# Altium schematic sheet [05] - POWER.SchDoc
size A2; Organization: Altium Limited; Address1: L3, 12a Rodborough Rd; Address2: Frenchs Forest; Address3: NSW; Address4: Australia 2086; DocumentNumber: 5; SheetNumber: 5; SheetTotal: 11
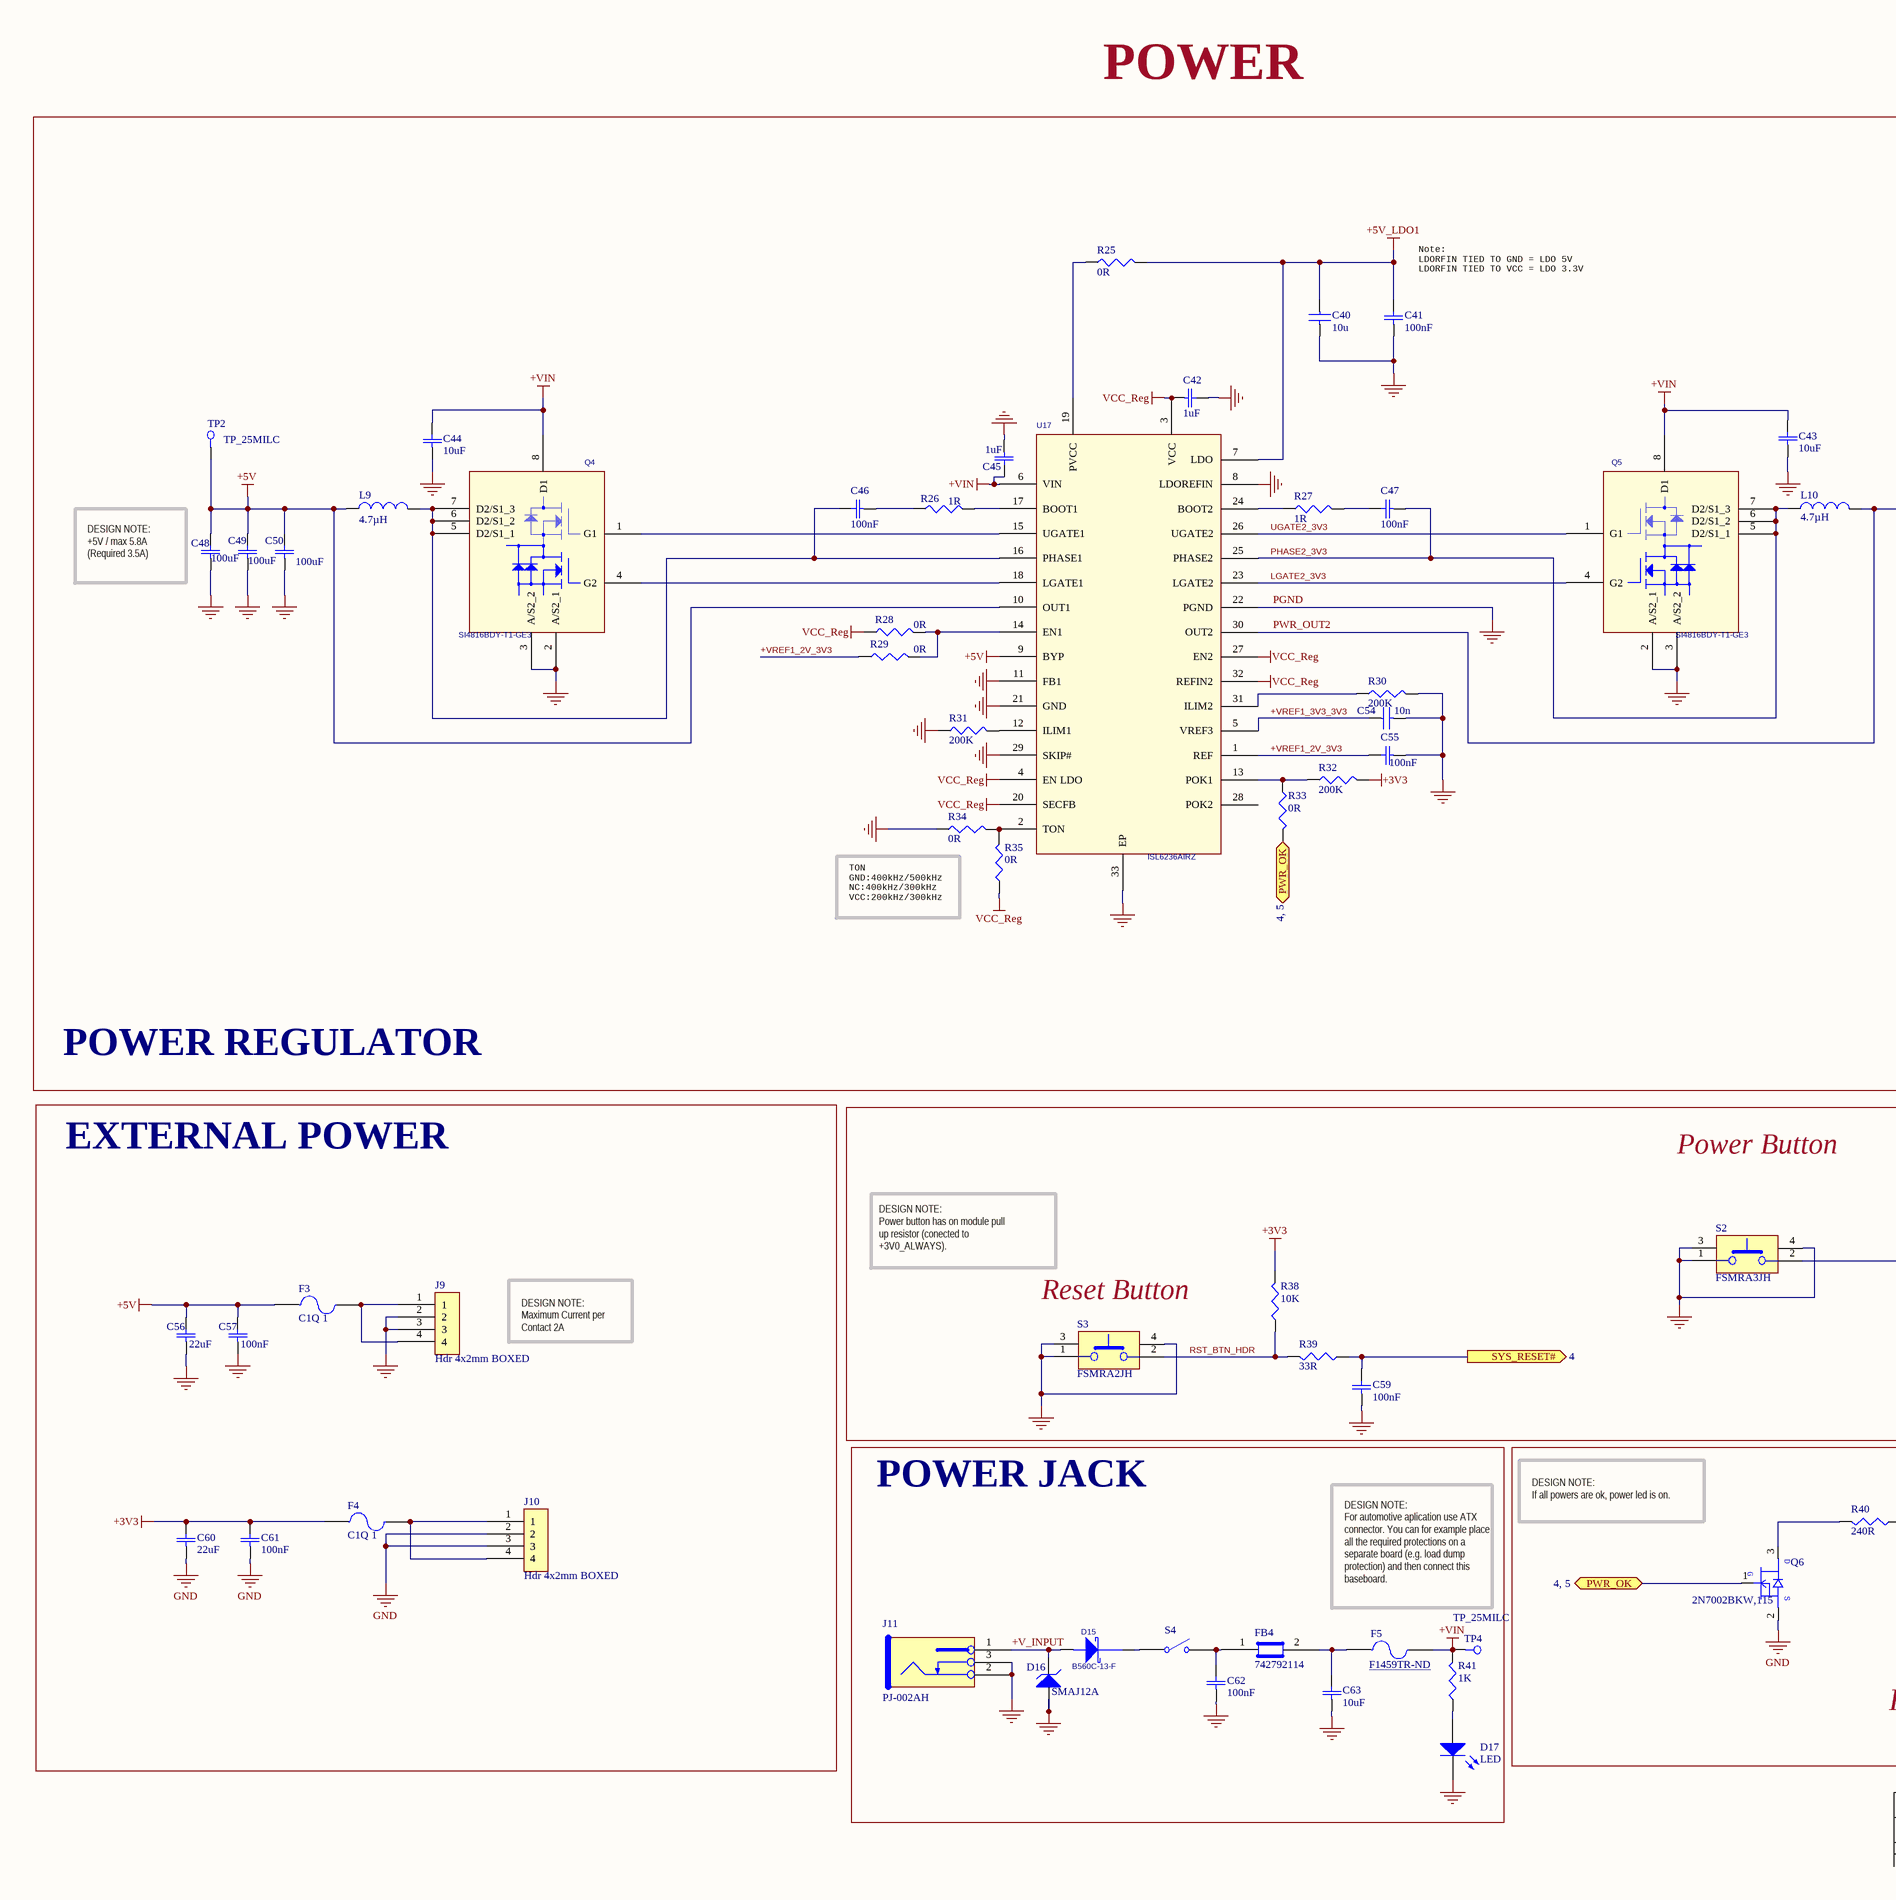
[diagram p0: [05] - POWER.SchDoc, left]
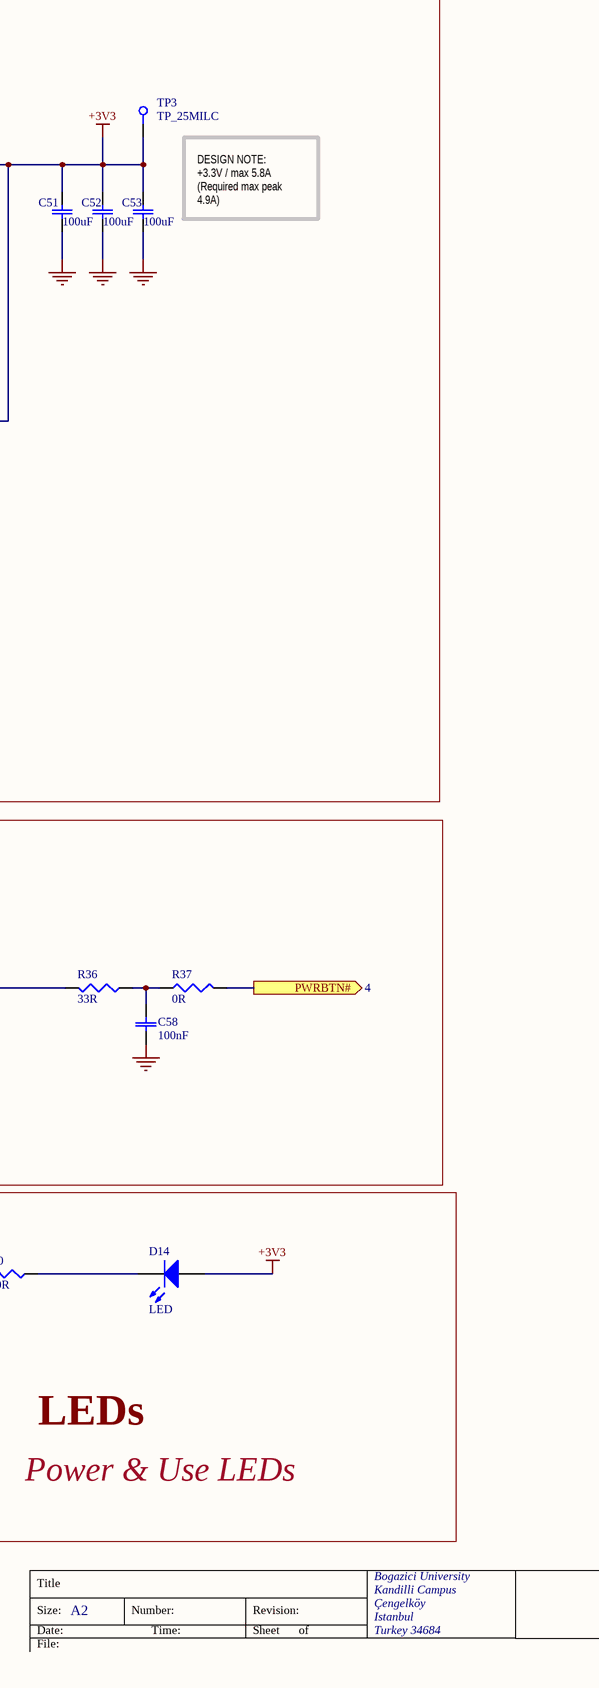
[diagram p1: [05] - POWER.SchDoc, right]

## Parts
C40  10u  [C0603]
C41  100nF  [C0402]
C42  1uF  [CAP_3216]
C43  10uF  [CAP_3216]
C44  10uF  [CAP_3216]
C45  1uF  [CAP_3216]
C46  100nF  [C0402]
C47  100nF  [C0402]
C48  100uF  [C1210C]
C49  100uF  [C1210C]
C50  100uF  [C1210C]
C51  100uF  [C1210C]
C52  100uF  [C1210C]
C53  100uF  [C1210C]
C54  10n  [C0402]
C55  100nF  [C0402]
C56  22uF  [C0805]
C57  100nF  [C0402]
C58  100nF  [C0402]
C59  100nF  [C0402]
C60  22uF  [C0805]
C61  100nF  [C0402]
C62  100nF  [C0402]
C63  10uF  [CAP_3216]
D14  LED  [D0603_Directional]
D15  B560C-13-F  [SMC]
D16  SMAJ12A  [SMA / DO-214AC]
D17  LED  [D0603_Directional]
F3  C1Q 1  [C1]
F4  C1Q 1  [C1]
F5  F1459TR-ND  [0466Series]
FB4  742792114  [Ferrite bead]
J9  Hdr 4x2mm BOXED  [HDR_1x4_2MM_SHDR]
J10  Hdr 4x2mm BOXED  [HDR_1x4_2MM_SHDR]
J11  PJ-002AH  [POWER_JACK_5.5_2.1MM_NS]
L9  4.7µH  [IHLP_255MILx270MIL]
L10  4.7µH  [IHLP_255MILx270MIL]
Q4  SI4816BDY-T1-GE3  [8_SOIC_3.9MM]
Q5  SI4816BDY-T1-GE3  [8_SOIC_3.9MM]
Q6  2N7002BKW,115  [SC70_SOT323]
R25  0R  [R0402]
R26  1R  [R0402]
R27  1R  [R0402]
R28  0R  [R0402]
R29  0R  [R0402]
R30  200K  [R0402]
R31  200K  [R0402]
R32  200K  [R0402]
R33  0R  [R0402]
R34  0R  [R0402]
R35  0R  [R0402]
R36  33R  [R0402]
R37  0R  [R0402]
R38  10K  [R0402]
R39  33R  [R0402]
R40  240R  [R0402]
R41  1K  [R0402]
S2  FSMRA3JH  [FSMRA3JH]
S3  FSMRA2JH  [FSMRA2JH]
S4  R1966ABLKBLKGR  [RockerSwitch]  (value not drawn)
TP2  TP_25MILC  [TP_25C]  (no BOM)
TP3  TP_25MILC  [TP_25C]  (no BOM)
TP4  TP_25MILC  [TP_25C]  (no BOM)
U17  ISL6236AIRZ  [32_VFQFN_EXPOSED_PAD]

## Blocks framed on the sheet
POWER REGULATOR: C40-C55 L9 L10 Q4 Q5 R25-R35 TP2 TP3 U17
EXTERNAL POWER: C56 C57 C60 C61 F3 F4 J9 J10
POWER JACK: C62 C63 D15-D17 F5 FB4 J11 R41 S4 TP4
LEDs: D14 Q6 R40

## Ports
PWR_OK (bidir, see 4, 5), PWRBTN# (out, see 4), SYS_RESET# (out, see 4)

## Nets
+5V: C48.2 C49.2 C50.2 C56.2 C57.2 F3.1 L9.1 TP2.1 U17.9(BYP) U17.10(OUT1)
+5V_LDO1: C40.1 C41.2 R25.2 U17.7(LDO)
+VIN: C43.2 C44.2 C45.2 F5.2 Q4.8(D1) Q5.8(D1) R41.2 TP4.1 U17.6(VIN)
PGND: C40.2 C41.1 C42.2 C43.1 C44.1 C45.1 C48.1 C49.1 C50.1 C51.1 C52.1 C53.1 C54.2 C55.1 C56.1 C57.1 C58.1 C59.1 C60.1 C61.1 C62.1 C63.1 D16.1(A) D17.2(K) J9.2 J9.3 J10.2 J10.3 J11.2 J11.3 Q4.2(A/S2_1) Q4.3(A/S2_2) Q5.2(A/S2_1) Q5.3(A/S2_2) Q6.2(SOURCE) R30.2 R31.1 R34.1 S2.1 S2.3(MECH1) S2.4(MECH2) S3.1 S3.3(MECH1) S3.4(MECH2) U17.8(LDOREFIN) U17.11(FB1) U17.21(GND) U17.22(PGND) U17.29(SKIP#) U17.33(EP)  [also labelled GND]
PWR_OUT2: C51.2 C52.2 C53.2 C60.2 C61.2 D14.1(A) F4.1 L10.2 R32.2 R38.2 TP3.1 U17.30(OUT2)  [also labelled +3V3]
VCC_Reg: C42.1 R28.1 R35.1 U17.3(VCC) U17.4(EN_LDO) U17.20(SECFB) U17.27(EN2) U17.32(REFIN2)
+V_INPUT: D15.2(ANODE) D16.2(K) J11.1
+VREF1_2V_3V3: C55.2 R29.1 U17.1(REF)
+VREF1_3V3_3V3: C54.1 U17.5(VREF3)
LGATE2_3V3: Q5.4(G2) U17.23(LGATE2)
PHASE2_3V3: C47.1 L10.1 Q5.5(D2/S1_1) Q5.6(D2/S1_2) Q5.7(D2/S1_3) U17.25(PHASE2)
PWR_OK: Q6.1(GATE) R33.2 ; port PWR_OK
PWRBTN#: R37.2 ; port PWRBTN#
RST_BTN_HDR: R38.1 R39.2 S3.2
SYS_RESET#: C59.2 R39.1 ; port SYS_RESET#
UGATE2_3V3: Q5.1(G1) U17.26(UGATE2)
NetC46_1: C46.1 R26.1
NetC46_2: C46.2 L9.2 Q4.5(D2/S1_1) Q4.6(D2/S1_2) Q4.7(D2/S1_3) U17.16(PHASE1)
NetC47_2: C47.2 R27.2
NetC58_2: C58.2 R36.1 R37.1
NetC62_2: C62.2 FB4.1 S4.2(NO)
NetC63_2: C63.2 F5.1 FB4.2
NetD14_2: D14.2(K) R40.1
NetD15_1: D15.1(cathode) S4.1(COMMON)
NetD17_1: D17.1(A) R41.1
NetF3_2: F3.2 J9.1 J9.4
NetF4_2: F4.2 J10.1 J10.4
NetQ4_1: Q4.1(G1) U17.15(UGATE1)
NetQ4_4: Q4.4(G2) U17.18(LGATE1)
NetQ6_3: Q6.3(DRAIN) R40.2
NetR25_1: R25.1 U17.19(PVCC)
NetR26_2: R26.2 U17.17(BOOT1)
NetR27_1: R27.1 U17.24(BOOT2)
NetR28_2: R28.2 R29.2 U17.14(EN1)
NetR30_1: R30.1 U17.31(ILIM2)
NetR31_2: R31.2 U17.12(ILIM1)
NetR32_1: R32.1 R33.1 U17.13(POK1)
NetR34_2: R34.2 R35.2 U17.2(TON)
NetR36_2: R36.2 S2.2

Not connected (* = marked no-connect by the designer): U17 28(POK2)

## Notes on the sheet
- POWER
- (near C41) Note:
  LDORFIN TIED TO GND = LDO 5V
  LDORFIN TIED TO VCC = LDO 3.3V
- DESIGN NOTE:
  +3.3V / max 5.8A
  (Required max peak 4.9A)
- (near C48) DESIGN NOTE:
  +5V / max 5.8A
  (Required 3.5A)
- TON
  GND:400kHz/500kHz
  NC:400kHz/300kHz
  VCC:200kHz/300kHz
- Power Button
- DESIGN NOTE:
  Power button has on module pull
  up resistor (conected to
  +3V0_ALWAYS).
- (near S3) Reset Button
- DESIGN NOTE:
  Maximum Current per Contact 2A
- DESIGN NOTE:
  If all powers are ok, power led is on.
- DESIGN NOTE:
  For automotive aplication use ATX connector. You can for example place all the required protections on a separate board (e.g. load dump protection) and then connect this baseboard.
- Power & Use LEDs
- Title
- Bogazici University
- Size:
- Date:
- File:
- A2
- Number:
- Time:
- Revision:
- Sheet
- of
- Kandilli Campus
- Çengelköy
- Istanbul
- Turkey 34684
- (in symbol 2N7002BKW,115) D; G; S

## Library data of the parts
C40 = C1608X5R0J106M: CAP CER 10UF 6.3V X5R 20% 0603; Manufacturer: TDK Corporation; Capacitance: 10µF; Value: 10µF; Category: Capacitors; Manufacturer Part Number: C1608X5R0J106M; Operating Temperature: -55°C ~ 85°C; Package / Case: 0603 (1608 Metric); Price 1k [$]: 0.08580; Voltage - Rated: 6.3V; Features: Low ESR; Supplier Part Number: 445-4112-1-ND; Supplier: Digikey; Supplier 1: Digi-Key; Supplier Part Number 1: 445-4112-1-ND; RoHS: RoHS Compliant; Stock 1: 48157; Pricing 1: 1=0.46, 10=0.363, 100=0.1898, 250=0.14024, 500=0.1089, 1000=0.0858 (USD); Tolerance: ±20%; Temperature Coefficient: X5R; Mounting Type: Surface Mount, MLCC; Applications: General Purpose; Ratings: -; Size / Dimension: 0.063" L x 0.031" W (1.60mm x 0.80mm); Height - Seated (Max): -; Thickness (Max): 0.037" (0.95mm); Lead Spacing: -; Packaging: Cut Tape (CT); Lead Style: -; ComponentLink1URL: http://www.tdk.com/pdf/general_B11.pdf; ComponentLink1Description: http://www.tdk.com/pdf/general_B11.pdf
C41 C46 C47 C55 C57-C59 C61 C62 = CL05A104KA5NNNC: CAP CER 0.1UF 50V X8R 0603; Manufacturer 1: Samsung Electro-Mechanics; Voltage - Rated: 25V; Tolerance: ±10%; Temperature Coefficient: X5R; Notification: Current market demand for these product types have resulted in fluctuating and extending lead times. Lead times may differ.; Description 1: CAP CER 0.1UF 25V X5R 0402; Category: Capacitors; Operating Temperature: -55°C ~ 85°C; Package / Case: 0402 (1005 Metric); Supplier 1: Digi-Key; Supplier Part Number 1: 1276-1043-6-ND; RoHS: RoHS Compliant; Stock 1: 100000; Pricing 1: 1=0.1, 10=0.04, 100=0.0176, 500=0.0126, 1000=0.0099, 2500=0.009, 5000=0.00828 (USD); Mounting Type: Surface Mount, MLCC; Applications: General Purpose; Ratings: -; Size / Dimension: 0.039" L x 0.020" W (1.00mm x 0.50mm); Height - Seated (Max): -; Thickness (Max): 0.022" (0.55mm); Lead Spacing: -; Features: -; Packaging: Digi-Reel®; Lead Style: -; ComponentLink1URL: http://www.samsungsem.com/kr/support/product-search/mlcc/CL05A104KA5NNNC.jsp; ComponentLink1Description: http://www.samsungsem.com/kr/support/product-search/mlcc/CL05A104KA5NNNC.jsp; Manufacturer Part Number 1: CL05A104KA5NNNC; Part Status: Active
C42 = CGA5L3X8R1H105K1: CAP CER 1UF 50V X8R 1206; Manufacturer_Part_Number: CGA5L3X8R1H105K160AB; Manufacturer 1: TDK Corporation; Vendor: TDK; Built_By: EMA_UL_Team; Type: DEV; C: Copyright (C) 2015 Accelerated Designs. All rights reserved; Tolerance: ±10%; RefDes: RefDes; Value: Value; Manufacturer Part Number 1: CGA5L3X8R1H105K160AB; RoHS: RoHS Compliant; Stock 1: 3285; Pricing 1: 1=0.85, 10=0.628, 100=0.4306, 500=0.34086, 1000=0.28704 (USD); Packaging: Cut Tape (CT); Part Status: Active; Voltage - Rated: 50V; Temperature Coefficient: X8R; Operating Temperature: -55°C ~ 150°C; Features: High Temperature; Ratings: AEC-Q200; Applications: Automotive; Failure Rate: -; Mounting Type: Surface Mount, MLCC; Package / Case: 1206 (3216 Metric); Size / Dimension: 0.126" L x 0.063" W (3.20mm x 1.60mm); Height - Seated (Max): -; Thickness (Max): 0.071" (1.80mm); Lead Spacing: -; Lead Style: -; ComponentLink1URL: https://product.tdk.com/info/en/catalog/datasheets/mlcc_automotive_hightemp_en.pdf; ComponentLink1Description: https://product.tdk.com/info/en/catalog/datasheets/mlcc_automotive_hightemp_en.pdf; Supplier 1: Digi-Key; Supplier Part Number 1: 445-13000-1-ND; Description 1: CAP CER 1UF 50V X8R 1206; Category: Capacitors
C43 C44 C63 = C3216JB1V106K160: CAP CER 10UF 35V JB 1206; Manufacturer_Part_Number: C3216JB1V106K160AB; Manufacturer 1: TDK Corporation; Tolerance: ±10%; Vendor: TDK; Built_By: EMA_UL_Team; Type: DEV; C: Copyright (C) 2015 Accelerated Designs. All rights reserved; Notification: Current market demand for these product types have resulted in fluctuating and extending lead times. Lead times may differ.; Category: Capacitors; Operating Temperature: -25°C ~ 85°C; Package / Case: 1206 (3216 Metric); Value: Value; Voltage - Rated: 35V; Supplier 1: Digi-Key; Supplier Part Number 1: 445-11736-1-ND; RoHS: RoHS Compliant; Stock 1: 5285; Pricing 1: 1=0.92, 10=0.648, 100=0.4269, 500=0.31626, 1000=0.26881 (USD); Temperature Coefficient: JB; Mounting Type: Surface Mount, MLCC; Applications: General Purpose; Ratings: -; Size / Dimension: 0.126" L x 0.063" W (3.20mm x 1.60mm); Height - Seated (Max): -; Thickness (Max): 0.069" (1.75mm); Lead Spacing: -; Features: Low ESL; Packaging: Cut Tape (CT); Lead Style: -; ComponentLink1URL: https://product.tdk.com/info/en/catalog/datasheets/mlcc_commercial_general_en.pdf; ComponentLink1Description: https://product.tdk.com/info/en/catalog/datasheets/mlcc_commercial_general_en.pdf; RefDes: RefDes; Manufacturer Part Number 1: C3216JB1V106K160AB; Part Status: Active; Failure Rate: -; Description 1: CAP CER 10UF 35V JB 1206
C45 = CGA5L3X8R1H105K1: CAP CER 1UF 50V X8R 1206; Manufacturer_Part_Number: CGA5L3X8R1H105K160AB; Manufacturer 1: TDK Corporation; Tolerance: ±10%; Vendor: TDK; Built_By: EMA_UL_Team; Type: DEV; C: Copyright (C) 2015 Accelerated Designs. All rights reserved; Category: Capacitors; Operating Temperature: -55°C ~ 150°C; Package / Case: 1206 (3216 Metric); Value: Value; Voltage - Rated: 50V; Supplier 1: Digi-Key; Supplier Part Number 1: 445-13000-1-ND; RoHS: RoHS Compliant; Stock 1: 3285; Pricing 1: 1=0.85, 10=0.628, 100=0.4306, 500=0.34086, 1000=0.28704 (USD); Temperature Coefficient: X8R; Mounting Type: Surface Mount, MLCC; Applications: Automotive; Ratings: AEC-Q200; Size / Dimension: 0.126" L x 0.063" W (3.20mm x 1.60mm); Height - Seated (Max): -; Thickness (Max): 0.071" (1.80mm); Lead Spacing: -; Features: High Temperature; Packaging: Cut Tape (CT); Lead Style: -; ComponentLink1URL: https://product.tdk.com/info/en/catalog/datasheets/mlcc_automotive_hightemp_en.pdf; ComponentLink1Description: https://product.tdk.com/info/en/catalog/datasheets/mlcc_automotive_hightemp_en.pdf; RefDes: RefDes; Manufacturer Part Number 1: CGA5L3X8R1H105K160AB; Part Status: Active; Failure Rate: -; Description 1: CAP CER 1UF 50V X8R 1206
C48-C53 = CL32A107MPVNNNE: CAP CER 100UF 10V X5R 1210; Manufacturer_Part_Number: C1210C107M8PACTU; Manufacturer 1: Samsung Electro-Mechanics; Tolerance: ±20%; Vendor: Kemet; Built_By: EMA_UL_Team; Type: DEV; C: Copyright (C) 2015 Accelerated Designs. All rights reserved; Notification: Current market demand for these product types have resulted in fluctuating and extending lead times. Lead times may differ.; Category: Capacitors; Operating Temperature: -55°C ~ 85°C; Package / Case: 1210 (3225 Metric); Value: 100uF; Voltage - Rated: 10V; Supplier 1: Digi-Key; Supplier Part Number 1: 1276-3364-1-ND; RoHS: RoHS Compliant; Stock 1: 10000; Pricing 1: 1=1.23, 10=0.97, 100=0.7277, 500=0.54984 (USD); Temperature Coefficient: X5R; Mounting Type: Surface Mount, MLCC; Applications: General Purpose; Ratings: -; Size / Dimension: 0.126" L x 0.098" W (3.20mm x 2.50mm); Height - Seated (Max): -; Thickness (Max): 0.110" (2.80mm); Lead Spacing: -; Features: -; Packaging: Cut Tape (CT); Lead Style: -; ComponentLink1URL: http://www.samsungsem.com/kr/support/product-search/mlcc/CL32A107MPVNNNE.jsp; ComponentLink1Description: http://www.samsungsem.com/kr/support/product-search/mlcc/CL32A107MPVNNNE.jsp; RefDes: RefDes; Manufacturer Part Number 1: CL32A107MPVNNNE; Part Status: Active; Description 1: CAP CER 100UF 10V X5R 1210
C54 = C1005X7R1C103K: CAP CER 10000PF 16V X7R 10% 0402; Manufacturer: TDK Corporation; Value: 10nF; Capacitance: 10000pF; Category: Capacitors; Manufacturer Part Number: C1005X7R1C103K; Operating Temperature: -55°C ~ 125°C; Package / Case: 0402 (1005 Metric); Price 1k [$]: 0.00416; Voltage - Rated: 16V; Supplier Part Number: 445-1262-1-ND; Supplier: Digikey; Supplier 1: Digi-Key; Supplier Part Number 1: 445-1262-1-ND; RoHS: RoHS Compliant; Stock 1: 511497; Pricing 1: 1=0.08, 10=0.05, 100=0.018, 250=0.013, 500=0.0096, 1000=0.0065 (USD); Tolerance: ±10%; Temperature Coefficient: X7R; Mounting Type: Surface Mount, MLCC; Applications: General Purpose; Ratings: -; Size / Dimension: 0.039" L x 0.020" W (1.00mm x 0.50mm); Height - Seated (Max): -; Thickness (Max): 0.022" (0.55mm); Lead Spacing: -; Features: -; Packaging: Cut Tape (CT); Lead Style: -; ComponentLink1URL: http://www.tdk.co.jp/tefe02/e412_c.pdf; ComponentLink1Description: http://www.tdk.co.jp/tefe02/e412_c.pdf
C56 C60 = CL21A226MOCLRNC: CAP CER 22UF 16V X5R 0805; Manufacturer 1: Samsung Electro-Mechanics; Tolerance: ±20%; Notification: Current market demand for these product types have resulted in fluctuating and extending lead times. Lead times may differ.; Supplier 1: Digi-Key; Supplier Part Number 1: 1276-6780-1-ND; RoHS: RoHS Compliant; Category: Capacitors; Stock 1: 40000; Pricing 1: 1=0.34, 10=0.233, 100=0.132, 500=0.09318, 1000=0.08153 (USD); Voltage - Rated: 16V; Temperature Coefficient: X5R; Mounting Type: Surface Mount, MLCC; Operating Temperature: -55°C ~ 85°C; Applications: General Purpose; Ratings: -; Package / Case: 0805 (2012 Metric); Size / Dimension: 0.079" L x 0.049" W (2.00mm x 1.25mm); Height - Seated (Max): -; Thickness (Max): 0.037" (0.95mm); Lead Spacing: -; Features: Low Profile; Packaging: Cut Tape (CT); Lead Style: -; ComponentLink1URL: http://www.samsungsem.com/kr/support/product-search/mlcc/CL21A226MOCLRNC.jsp; ComponentLink1Description: http://www.samsungsem.com/kr/support/product-search/mlcc/CL21A226MOCLRNC.jsp; Manufacturer Part Number 1: CL21A226MOCLRNC; Part Status: Active; Description 1: CAP CER 22UF 16V X5R 0805
D14 D17 = LW Q38E-Q1OO-3K6L-1: LED COOL WHITE DIFFUSED 0603 SMD; Manufacturer 1: OSRAM Opto Semiconductors Inc.; Color: White, Cool; Lens Color: Yellow; Millicandela Rating: 81mcd; Lens Style/Size: Rectangle with Flat Top, 1.10mm x 0.80mm; Voltage - Forward (Vf) (Typ): 2.85V; Current - Test: 5mA; Viewing Angle: 150°, 130°; Wavelength - Dominant: 8200K; Supplier 1: Digi-Key; Supplier Part Number 1: 475-2831-1-ND; Manufacturer Part Number 1: LW Q38E-Q1OO-3K6L-1; RoHS: RoHS Compliant; Description 1: LED COOL WHITE DIFFUSED 0603 SMD; Category: Optoelectronics; Stock 1: 215520; Pricing 1: 1=0.49, 10=0.354, 25=0.2888, 100=0.231, 250=0.19492, 500=0.16604, 1000=0.12994 (USD); Packaging: Cut Tape (CT); Part Status: Active; Lens Transparency: Diffused; Mounting Type: Surface Mount; Wavelength - Peak: -; Features: -; Package / Case: 0603 (1608 Metric); Supplier Device Package: 0603; Size / Dimension: 1.60mm L x 0.80mm W; Height (Max): 0.40mm; ComponentLink1URL: https://dammedia.osram.info/media/resource/hires/osram-dam-2493068/LW%20Q38E.pdf; ComponentLink1Description: https://dammedia.osram.info/media/resource/hires/osram-dam-2493068/LW%20Q38E.pdf
D15 = B560C-13-F: DIODE SCHOTTKY 60V 5A SMC; Manufacturer: Diodes Inc; Voltage - Forward (Vf) (Max) @ If: 700mV @ 5A; Speed: Fast Recovery =< 500ns, > 200mA (Io); Current - Reverse Leakage @ Vr: 500µA @ 60V; Capacitance @ Vr, F: 300pF @ 4V, 1MHz; Category: Discrete Semiconductor Products; Supplier Part Number: B560C-FDICT-ND; Manufacturer Part Number: B560C-13-F; Price 1k [$]: 0.42900; Value: B560C-13-F; Package / Case: DO-214AB, SMC; Supplier: Digikey; Family: Diodes, Rectifiers - Single; Voltage - DC Reverse (Vr) (Max): 60V; Current - Average Rectified (Io): 5A; Diode Type: Schottky; Supplier 1: Digi-Key; Supplier Part Number 1: B560C-FDICT-ND; RoHS: RoHS Compliant; Stock 1: 37770; Pricing 1: 1=0.99, 10=0.884, 100=0.702, 250=0.611, 500=0.546, 1000=0.429 (USD); Reverse Recovery Time (trr): -; Mounting Type: Surface Mount; Supplier Device Package: SMC; Packaging: Cut Tape (CT); ComponentLink1URL: http://www.diodes.com/datasheets/ds13012.pdf; ComponentLink1Description: http://www.diodes.com/datasheets/ds13012.pdf
D16 = SMAJ12A: TVS DIODE 12V 19.9V SMA; Manufacturer 1: Bourns Inc.; Type: Zener; Voltage - Breakdown (Min): 13.3V; Current - Peak Pulse (10/1000µs): 20.1A; Power - Peak Pulse: 400W; Power Line Protection: No; Supplier 1: Digi-Key; RoHS: RoHS Compliant; Category: Circuit Protection; Stock 1: 20326; Pricing 1: 1=0.47, 10=0.329, 25=0.27, 100=0.216, 250=0.15712, 500=0.12766, 1000=0.0982, 2500=0.08838 (USD); Packaging: Cut Tape (CT); Part Status: Active; Voltage - Reverse Standoff (Typ): 12V; Voltage - Clamping (Max) @ Ipp: 19.9V; Applications: General Purpose; Capacitance @ Frequency: -; Operating Temperature: -55°C ~ 150°C (TJ); Mounting Type: Surface Mount; Package / Case: DO-214AC, SMA; Supplier Device Package: SMA (DO-214AC); ComponentLink1URL: https://www.bourns.com/docs/Product-Datasheets/SMAJ.pdf; ComponentLink1Description: https://www.bourns.com/docs/Product-Datasheets/SMAJ.pdf; Supplier Part Number 1: SMAJ12ABCT-ND; Published: 8-Jun-2000; LatestRevisionDate: 17-Jul-2002; LatestRevisionNote: Re-released for DXP Platform.; PackageReference: DIODE-0.7; Publisher: Altium Limited; PackageDescription: Diode, Thru-Hole; 2 Leads; 0.7 in Pin Spacing; Manufacturer Part Number 1: SMAJ12A; Description 1: TVS DIODE 12V 19.9V SMA
F3 F4 = C1Q 1: FUSE BOARD MOUNT 1A 125VAC 63VDC; Manufacturer 1: Bel Fuse Inc.; Fuse Type: Board Mount (Cartridge Style Excluded); Response Time: Fast; Breaking Capacity @ Rated Voltage: 100A AC, 50A DC; Approvals: CE, CSA, cULus; Supplier 1: Digi-Key; Supplier Part Number 1: 507-1077-1-ND; Manufacturer Part Number 1: C1Q 1; RoHS: RoHS Compliant; Description 1: FUSE BOARD MOUNT 1A 125VAC 63VDC; Category: Circuit Protection; Stock 1: 81500; Pricing 1: 1=0.33, 5=0.318, 10=0.304, 50=0.2714, 100=0.2526, 250=0.22452, 500=0.18712, 1000=0.17775 (USD); Packaging: Cut Tape (CT); Part Status: Active; Package / Case: 1206 (3216 Metric); Mounting Type: Surface Mount; Operating Temperature: -55°C ~ 125°C; Color: -; Size / Dimension: 0.126" L x 0.062" W x 0.023" H (3.20mm x 1.58mm x 0.58mm); ComponentLink1URL: https://belfuse.com/resources/datasheets/circuitprotection/ds-cp-c1q-series.pdf; ComponentLink1Description: https://belfuse.com/resources/datasheets/circuitprotection/ds-cp-c1q-series.pdf
F5 = 0466004.NR: FUSE BOARD MNT 4A 32VAC/VDC 1206; Manufacturer 1: Littelfuse Inc.; Manufacturer Part Number 1: 0466004.NRHF; Fuse Type: Board Mount (Cartridge Style Excluded); Response Time: Fast; Breaking Capacity @ Rated Voltage: 50A; Approvals: CSA, UL; Supplier 1: Digi-Key; Supplier Part Number 1: F6018DKR-ND; RoHS: RoHS Compliant; Description 1: FUSE BOARD MNT 4A 32VAC/VDC 1206; Category: Circuit Protection; Stock 1: 4728; Pricing 1: 1=0.84, 5=0.812, 10=0.787, 50=0.6618, 100=0.5493, 250=0.4994, 500=0.4245, 1000=0.37455 (USD); Packaging: Digi-Reel®; Part Status: Active; Package / Case: 1206 (3216 Metric); Mounting Type: Surface Mount; Operating Temperature: -55°C ~ 90°C; Color: -; Size / Dimension: 0.125" L x 0.060" W x 0.023" H (3.18mm x 1.52mm x 0.58mm); ComponentLink1URL: http://www.littelfuse.com/~/media/electronics/datasheets/fuses/littelfuse_fuse_466_datasheet.pdf.pdf; ComponentLink1Description: http://www.littelfuse.com/~/media/electronics/datasheets/fuses/littelfuse_fuse_466_datasheet.pdf.pdf
FB4 = FB742792114: FERRITE BEAD 50 OHM 1206 1LN; Filter Type: Signal Line; Current Rating (Max): 3A; DC Resistance (DCR) (Max): 25 mOhm; Supplier 1: Digi-Key; Supplier Part Number 1: 732-1621-6-ND; Manufacturer 2: Wurth Electronics Inc.; Manufacturer Part Number 2: 742792114; RoHS: RoHS Compliant; Stock 2: 21934; Pricing 2: 1=0.24, 10=0.238, 50=0.219, 100=0.209, 500=0.2, 1000=0.19 (USD); Packaging: Cut Tape (CT); Part Status: Active; Ratings: -; Operating Temperature: -55°C ~ 125°C; Package / Case: 1206 (3216 Metric); Mounting Type: Surface Mount; Height (Max): 0.051" (1.30mm); Size / Dimension: 0.126" L x 0.063" W (3.20mm x 1.60mm); ComponentLink1URL: http://katalog.we-online.de/pbs/datasheet/742792114.pdf; ComponentLink1Description: http://katalog.we-online.de/pbs/datasheet/742792114.pdf; Supplier 2: Digi-Key; Supplier Part Number 2: 732-1621-1-ND; Description 2: FERRITE BEAD 50 OHM 1206 1LN; Category: Filters
J9 J10 = 0532530470: CONN HEADER 4POS 2MM VERT TIN; Manufacturer: Molex Inc; Connector Type: Header, Shrouded; Number of Positions: 4; Number of Positions Loaded: All; Pitch: 0.079" (2.00mm); .Creator: MM; Supplier 1: Digi-Key; Manufacturer Part Number: 0532530470; RoHS: RoHS Compliant; Category: Connectors, Interconnects; Stock 1: 5160; Pricing 1: 1=0.23, 10=0.211, 50=0.1576, 100=0.1464, 250=0.12948, 500=0.12386, 1000=0.10134, 2500=0.0929, 5000=0.09008 (USD); Packaging: Tray; Contact Type: Male Pin; Number of Rows: 1; Row Spacing: -; Contact Mating Length: 0.130" (3.30mm); Mounting Type: Through Hole; Termination: Press-Fit; Fastening Type: -; Features: -; Contact Finish: Tin; Contact Finish Thickness: -; Color: -; ComponentLink1URL: http://www.molex.com/pdm_docs/sd/532530270_sd.pdf; ComponentLink1Description: http://www.molex.com/pdm_docs/sd/532530270_sd.pdf; Supplier Part Number 1: WM19006-ND
J11 = PJ-002AH: CONN PWR JACK 2.1X5.5MM HIGH CUR; Manufacturer: CUI Inc; Mating connector: 2.1mm ID, 5.5mm OD; Gender: Male; Number of Positions/Contacts: 2 Conductors, 3 Contacts; Internal Switch(s): Single Switch, Normally Closed; Shielding: Unshielded; Voltage - Rated: 24VDC; Current Rating: 5A; Category: Connectors, Interconnects; Family: Barrel - Power; Manufacturer Part Number: PJ-002AH; Operating Temperature: -25°C ~ 85°C; Price 1k [$]: 0.23625; Supplier: Digikey; Supplier Part Number: CP-002AH-ND; Value: PJ-002AH; Supplier 1: Digi-Key; Supplier Part Number 1: CP-002AH-ND; RoHS: RoHS Compliant; Stock 1: 138933; Pricing 1: 1=1.01, 10=0.704, 100=0.4724, 500=0.3819, 1000=0.3417, 2500=0.27135 (USD); Connector Type: Jack; Plug/Mating Plug Diameter: 2.1mm ID, 5.5mm OD; Mounting Type: Through Hole, Right Angle; Termination: Solder Eyelet(s); Features: -; Color: Black; Contact Material: Copper Alloy; Contact Material - Plating: Nickel; Housing Color: Black; Housing Material: Thermoplastic; ComponentLink1URL: http://products.cui.com/GetSpecForDigiKey.aspx?MFGNum=PJ-002AH; ComponentLink1Description: http://products.cui.com/GetSpecForDigiKey.aspx?MFGNum=PJ-002AH
L9 L10 = IHLP2525CZER4R7M01: INDUCTOR POWER 4.7UH 5.5A SMD; Manufacturer: Vishay/Dale; Current - Saturation: 10A; Shielding: Shielded; DC Resistance (DCR): 40 mOhm Max; Tolerance: ±20%; Frequency - Test: 100kHz; Category: Inductors, Coils, Chokes; Manufacturer Part Number: IHLP2525CZER4R7M01; Operating Temperature: -55°C ~ 125°C; Package / Case: 0.270" L x 0.255" W x 0.118" H (6.86mm x 6.47mm x 3.00mm); Price 1k [$]: 1.09800; Value: 4.7µH; Inductance: 4.7µH; Current: 5.5A; Applications: General Purpose; Supplier Part Number: 541-1010-1-ND; Supplier: Digikey; Supplier 1: Digi-Key; Supplier Part Number 1: 541-1010-1-ND; RoHS: RoHS Compliant; Stock 1: 25684; Pricing 1: 1=2.26, 10=1.83, 100=1.525, 500=1.22, 1000=1.098 (USD); Current - Temperature Rise: 5.5A; Type: -; Q @ Freq: -; Frequency - Self Resonant: -; Material - Core: -; Mounting Type: Surface Mount; Packaging: Cut Tape (CT); ComponentLink1URL: http://www.vishay.com/doc?34104; ComponentLink1Description: http://www.vishay.com/doc?34104
Q4 Q5 = SI4816BDY-T1-GE3: MOSFET DL N-CH 30V 6.8A 8-SOIC; Manufacturer: Vishay/Siliconix; FET Type: 2 N-Channel (Dual); FET Feature: Logic Level Gate; Rds On (Max) @ Id, Vgs: 18.5 mOhm @ 6.8A, 10V; Current - Continuous Drain (Id) @ 25° C: 5.8A, 8.2A; Vgs(th) (Max) @ Id: 3V @ 250µA; Power - Max: 1W, 1.25W; Gate Charge (Qg) @ Vgs: 10nC @ 5V; Category: Discrete Semiconductor Products; Manufacturer Part Number: SI4816BDY-T1-GE3; Package / Case: 8-SOIC (0.154", 3.90mm Width); Price 1k [$]: 0.84800; Value: SI4816BDY-T1-GE3; Family: FETs - Arrays; Drain to Source Voltage (Vdss): 30V; Supplier Part Number: SI4816BDY-T1-GE3CT-ND; Supplier: Digikey; Supplier 1: Digi-Key; Supplier Part Number 1: SI4816BDY-T1-GE3CT-ND; RoHS: RoHS Compliant; Stock 1: 15735; Pricing 1: 1=1.84, 25=1.4228, 100=1.2912, 250=1.1594, 500=1.0013, 1000=0.8432 (USD); Input Capacitance (Ciss) @ Vds: -; Mounting Type: Surface Mount; Supplier Device Package: 8-SOICN; Packaging: Cut Tape (CT); ComponentLink1URL: http://www.vishay.com/docs/73026/si4816bd.pdf; ComponentLink1Description: http://www.vishay.com/docs/73026/si4816bd.pdf
Q6 = 2N7002BKW,115: MOSFET N-CH 60V 310MA SOT323; Manufacturer: NXP Semiconductors; FET Type: MOSFET N-Channel, Metal Oxide; FET Feature: Logic Level Gate; Rds On (Max) @ Id, Vgs: 1.6 Ohm @ 500mA, 10V; Vgs(th) (Max) @ Id: 2.1V @ 250µA; Gate Charge (Qg) @ Vgs: 0.6nC @ 4.5V; Input Capacitance (Ciss) @ Vds: 50pF @ 10V; Power - Max: 275mW; Supplier 1: Digi-Key; Supplier Part Number 1: 568-5980-1-ND; Manufacturer Part Number: 2N7002BKW,115; RoHS: RoHS Compliant; Category: Discrete Semiconductor Products; Stock 1: 15666; Pricing 1: 1=0.39, 10=0.354, 25=0.2548, 100=0.1983, 250=0.12456, 500=0.10616, 1000=0.07233 (USD); Drain to Source Voltage (Vdss): 60V; Current - Continuous Drain (Id) @ 25° C: 310mA; Mounting Type: Surface Mount; Package / Case: SC-70, SOT-323; Supplier Device Package: SC-70; Packaging: Cut Tape (CT); ComponentLink1URL: http://www.nxp.com/documents/data_sheet/2N7002BKW.pdf; ComponentLink1Description: http://www.nxp.com/documents/data_sheet/2N7002BKW.pdf
R25 R28 R29 R33-R35 R37 = RC1005J000CS: RES SMD 0 OHM JUMPER 1/16W 0402; Manufacturer 1: Samsung Electro-Mechanics; Power (Watts): 0.063W, 1/16W; Category: Resistors; Package / Case: 0402 (1005 Metric); Tolerance: Jumper; Supplier 1: Digi-Key; Supplier Part Number 1: 1276-3480-6-ND; RoHS: RoHS Compliant; Stock 1: 9624698; Pricing 1: 1=0.1, 10=0.016, 25=0.0116, 50=0.009, 100=0.0066, 250=0.005, 500=0.004, 1000=0.00295, 5000=0.00211 (USD); Composition: Thick Film; Features: Moisture Resistant; Temperature Coefficient: -; Size / Dimension: 0.039" L x 0.020" W (1.00mm x 0.50mm); Packaging: Digi-Reel®; ComponentLink1URL: http://www.samsungsem.com/kr/support/product-search/chip-resistor/RC1005J000CS.jsp; ComponentLink1Description: http://www.samsungsem.com/kr/support/product-search/chip-resistor/RC1005J000CS.jsp; Manufacturer Part Number 1: RC1005J000CS; Part Status: Active; Operating Temperature: -55°C ~ 155°C; Supplier Device Package: 0402; Height - Seated (Max): 0.016" (0.40mm); Failure Rate: -; Description 1: RES SMD 0 OHM JUMPER 1/16W 0402
R26 R27 = RC0402FR-071RL: RES 1.00 OHM 1/16W 1% 0402 SM; Manufacturer: Yageo; Resistance (Ohms): 1; Power (Watts): 0.063W, 1/16W; Temperature Coefficient: ±200ppm/°C; Category: Resistors; Manufacturer Part Number: RC0402FR-071RL; Package / Case: 0402 (1005 Metric); Price 1k [$]: 0.01421; Tolerance: ±1%; Value: 1R; Supplier Part Number: 311-1.00LRCT-ND; Supplier: Digikey; Supplier 1: Digi-Key; Supplier Part Number 1: 311-1.00LRCT-ND; RoHS: RoHS Compliant; Stock 1: 347765; Pricing 1: 10=0.019, 50=0.0142, 100=0.0109, 250=0.00808, 500=0.00596, 1000=0.00397 (USD); Composition: Thick Film; Features: -; Size / Dimension: 0.039" L x 0.020" W (1.00mm x 0.50mm); Height: 0.016" (0.40mm); Number of Terminations: 2; Packaging: Cut Tape (CT); ComponentLink1URL: http://www.yageo.com/documents/recent/PYu-RC0402_51_RoHS_L_6.pdf; ComponentLink1Description: http://www.yageo.com/documents/recent/PYu-RC0402_51_RoHS_L_6.pdf
R30-R32 = RC1005F204CS: RES SMD 200K OHM 1% 1/16W 0402; Manufacturer 1: Samsung Electro-Mechanics; Power (Watts): 0.063W, 1/16W; Temperature Coefficient: ±100ppm/°C; Category: Resistors; Package / Case: 0402 (1005 Metric); Tolerance: ±1%; Supplier 1: Digi-Key; Supplier Part Number 1: 1276-3449-6-ND; RoHS: RoHS Compliant; Stock 1: 325433; Pricing 1: 1=0.1, 10=0.021, 100=0.0087, 1000=0.00391, 2500=0.00339, 5000=0.0028 (USD); Composition: Thick Film; Features: Moisture Resistant; Size / Dimension: 0.039" L x 0.020" W (1.00mm x 0.50mm); Packaging: Digi-Reel®; ComponentLink1URL: http://www.samsungsem.com/kr/support/product-search/chip-resistor/RC1005F204CS.jsp; ComponentLink1Description: http://www.samsungsem.com/kr/support/product-search/chip-resistor/RC1005F204CS.jsp; Manufacturer Part Number 1: RC1005F204CS; Part Status: Active; Operating Temperature: -55°C ~ 155°C; Supplier Device Package: 0402; Height - Seated (Max): 0.016" (0.40mm); Failure Rate: -; Description 1: RES SMD 200K OHM 1% 1/16W 0402
R36 R39 = ERJ-2RKF33R0X: RES SMD 33 OHM 1% 1/10W 0402; Manufacturer 1: Panasonic Electronic Components; Power (Watts): 0.1W, 1/10W; Temperature Coefficient: ±100ppm/°C; Category: Resistors; Package / Case: 0402 (1005 Metric); Tolerance: ±1%; Supplier 1: Digi-Key; Supplier Part Number 1: P33.0LDKR-ND; RoHS: RoHS Compliant; Stock 1: 459707; Pricing 1: 1=0.1, 10=0.056, 100=0.0227, 1000=0.01021, 2500=0.00886, 5000=0.00732 (USD); Composition: Thick Film; Features: Automotive AEC-Q200; Size / Dimension: 0.039" L x 0.020" W (1.00mm x 0.50mm); Packaging: Digi-Reel®; ComponentLink1URL: https://industrial.panasonic.com/cdbs/www-data/pdf/RDA0000/AOA0000C304.pdf; ComponentLink1Description: https://industrial.panasonic.com/cdbs/www-data/pdf/RDA0000/AOA0000C304.pdf; Manufacturer Part Number 1: ERJ-2RKF33R0X; Part Status: Active; Operating Temperature: -55°C ~ 155°C; Supplier Device Package: 0402; Height - Seated (Max): 0.016" (0.40mm); Failure Rate: -; Description 1: RES SMD 33 OHM 1% 1/10W 0402
R38 = RC1005F103CS: RES SMD 10K OHM 1% 1/16W 0402; Manufacturer 1: Samsung Electro-Mechanics; Power (Watts): 0.063W, 1/16W; Temperature Coefficient: ±100ppm/°C; Category: Resistors; Package / Case: 0402 (1005 Metric); Tolerance: ±1%; Supplier 1: Digi-Key; Supplier Part Number 1: 1276-3431-6-ND; RoHS: RoHS Compliant; Stock 1: 12738811; Pricing 1: 1=0.1, 10=0.021, 100=0.0087, 1000=0.00391, 2500=0.00339, 5000=0.0028 (USD); Composition: Thick Film; Features: Moisture Resistant; Size / Dimension: 0.039" L x 0.020" W (1.00mm x 0.50mm); Packaging: Digi-Reel®; ComponentLink1URL: http://www.samsungsem.com/kr/support/product-search/chip-resistor/RC1005F103CS.jsp; ComponentLink1Description: http://www.samsungsem.com/kr/support/product-search/chip-resistor/RC1005F103CS.jsp; Manufacturer Part Number 1: RC1005F103CS; Part Status: Active; Operating Temperature: -55°C ~ 155°C; Supplier Device Package: 0402; Height - Seated (Max): 0.016" (0.40mm); Failure Rate: -; Description 1: RES SMD 10K OHM 1% 1/16W 0402
R40 = RMCF0402FT240R: RES TF 240 OHM 1% 0.0625W 0402; Manufacturer: Stackpole Electronics Inc; Resistance (Ohms): 240; Power (Watts): 0.063W, 1/16W; Temperature Coefficient: ±100ppm/°C; Category: Resistors; Supplier Part Number: RMCF0402FT240RCT-ND; Manufacturer Part Number: RMCF0402FT240R; Package / Case: 0402 (1005 Metric); Price 1k [$]: 0.00384; Tolerance: ±1%; Value: 240R; Supplier: Digikey; Supplier 1: Digi-Key; Supplier Part Number 1: RMCF0402FT240RCT-ND; RoHS: RoHS Compliant; Stock 1: 39860; Pricing 1: 1=0.04, 10=0.025, 50=0.0138, 100=0.0105, 250=0.0078, 500=0.00576, 1000=0.00384 (USD); Composition: Thick Film; Features: -; Size / Dimension: 0.039" L x 0.020" W (1.00mm x 0.50mm); Height: 0.016" (0.40mm); Number of Terminations: 2; Packaging: Cut Tape (CT); ComponentLink1URL: http://www.seielect.com/Catalog/SEI-RMCF.pdf; ComponentLink1Description: http://www.seielect.com/Catalog/SEI-RMCF.pdf
R41 = ERJ-2RKF1001X: RES SMD 1K OHM 1% 1/10W 0402; Manufacturer 1: Panasonic Electronic Components; Power (Watts): 0.1W, 1/10W; Temperature Coefficient: ±100ppm/°C; Manufacturer Part Number 1: ERJ-2RKF1001X; RoHS: RoHS Compliant; Stock 1: 18630560; Pricing 1: 1=0.1, 10=0.056, 100=0.0227, 1000=0.01021, 2500=0.00886, 5000=0.00732 (USD); Packaging: Digi-Reel®; Part Status: Active; Tolerance: ±1%; Composition: Thick Film; Features: Automotive AEC-Q200; Operating Temperature: -55°C ~ 155°C; Package / Case: 0402 (1005 Metric); Supplier Device Package: 0402; Size / Dimension: 0.039" L x 0.020" W (1.00mm x 0.50mm); Height - Seated (Max): 0.016" (0.40mm); Failure Rate: -; ComponentLink1URL: https://industrial.panasonic.com/cdbs/www-data/pdf/RDA0000/AOA0000C304.pdf; ComponentLink1Description: https://industrial.panasonic.com/cdbs/www-data/pdf/RDA0000/AOA0000C304.pdf; Supplier 1: Digi-Key; Supplier Part Number 1: P1.00KLDKR-ND; Description 1: RES SMD 1K OHM 1% 1/10W 0402; Category: Resistors
S2 = FSMRA3JH: SWITCH TACTILE SPST-NO 0.05A 12V; Manufacturer: TE Connectivity; Switch Function: Off-Mom; Contact Rating @ Voltage: 0.05A @ 12VDC; Actuator Type: Standard; Actuator Height off PCB, from Pins: 5.85mm; Actuator Orientation: Side Actuated; Outline: 7.10mm x 7.00mm; Illumination: Non-Illuminated; Operating Force: 160gf; Actuator Material: Polyamide (PA), Nylon; Switch Travel: 0.25mm; Mechanical Life: 100,000 Cycles; .Creator: MM; Supplier 1: Digi-Key; Manufacturer Part Number: FSMRA3JH; RoHS: RoHS Compliant; Category: Switches; Stock 1: 37985; Pricing 1: 1=0.15, 10=0.143, 25=0.1376, 50=0.1328, 100=0.1255, 250=0.11808, 500=0.11316, 1000=0.0861 (USD); Packaging: Bulk; Circuit: SPST-NO; Mounting Type: Through Hole, Right Angle; Termination Style: PC Pin; Illumination Voltage (Nominal): -; Illumination Type, Color: -; Ingress Protection: -; Features: -; Operating Temperature: -35°C ~ 85°C; ComponentLink1URL: http://www.te.com/commerce/DocumentDelivery/DDEController?Action=srchrtrv&DocNm=1825027&DocType=Customer+Drawing&DocLang=English; ComponentLink1Description: http://www.te.com/commerce/DocumentDelivery/DDEController?Action=srchrtrv&DocNm=1825027&DocType=Customer+Drawing&DocLang=English; Supplier Part Number 1: 450-1657-ND
S3 = FSMRA2JH: SWITCH TACTILE SPST-NO 0.05A 24V; Manufacturer 1: TE Connectivity ALCOSWITCH Switches; Manufacturer Part Number 1: 1825027-5; Switch Function: Off-Mom; Contact Rating @ Voltage: 0.05A @ 24VDC; Actuator Type: Standard; Actuator Length, Right Angle: 3.86mm; Actuator Orientation: Side Actuated; Outline: 7.10mm x 7.00mm; Illumination: Non-Illuminated; Operating Force: 160gf; Actuator Material: Polybutylene Terephthalate (PBT); Switch Travel: 0.25mm; Mechanical Life: 100,000 Cycles; RoHS: RoHS Compliant; Stock 1: 37455; Pricing 1: 1=0.17, 10=0.169, 25=0.1628, 50=0.157, 100=0.1482, 250=0.13952, 500=0.1337, 1000=0.10173, 5000=0.08429 (USD); Packaging: Bulk; Part Status: Active; Circuit: SPST-NO; Mounting Type: Through Hole, Right Angle; Actuator Height off PCB, Vertical: -; Termination Style: PC Pin; Illumination Type, Color: -; Illumination Voltage (Nominal): -; Ingress Protection: -; Features: -; Operating Temperature: -35°C ~ 85°C; ComponentLink1URL: http://www.te.com/commerce/DocumentDelivery/DDEController?Action=srchrtrv&DocNm=1825027&DocType=Customer+Drawing&DocLang=English; ComponentLink1Description: http://www.te.com/commerce/DocumentDelivery/DDEController?Action=srchrtrv&DocNm=1825027&DocType=Customer+Drawing&DocLang=English; Supplier 1: Digi-Key; Supplier Part Number 1: 450-1662-ND; Description 1: SWITCH TACTILE SPST-NO 0.05A 24V; Category: Switches
S4 = R1966ABLKBLKGR: SWITCH ROCKER SPST 15A 125V; Manufacturer 1: E-Switch; Switch Function: On-Off; Current Rating: 15A (AC); Actuator Type: Concave (Curved); Color - Actuator/Cap: Black; Actuator Marking: O I; Mechanical Life: 30,000 Cycles; Electrical Life: 10,000 Cycles; Supplier 1: Digi-Key; Supplier Part Number 1: EG2578-ND; Manufacturer Part Number 1: R1966ABLKBLKGR; RoHS: RoHS Compliant; Description 1: SWITCH ROCKER SPST 15A 125V; Category: Switches; Stock 1: 9; Pricing 1: 1=1.58, 10=1.507, 25=1.4384, 50=1.37, 100=1.3015, 250=1.26724, 500=1.19876, 1000=1.06175, 5000=1.0275 (USD); Packaging: Bulk; Part Status: Active; Circuit: SPST; Illumination Type, Color: -; Illumination Voltage (Nominal): -; Mounting Type: Panel Mount, Snap-In, Right Angle; Termination Style: PC Pin; Ingress Protection: -; Features: -; Panel Cutout Dimensions: Rectangular - 19.40mm x 13.00mm; Operating Temperature: -30°C ~ 65°C; ComponentLink1URL: http://spec_sheets.e-switch.com/specs/M301223.pdf; ComponentLink1Description: http://spec_sheets.e-switch.com/specs/M301223.pdf; Published: 24-Mar-1999; LatestRevisionDate: 17-Jul-2002; LatestRevisionNote: Re-released for DXP Platform.; PackageReference: SPST-2; Publisher: Altium Limited; PackageDescription: Switch; 2 Leads
TP2-TP4 = TP_25MILC: Test Point 25mil
U17 = ISL6236AIRZ: IC MAIN PWR CTRLR QUAD 32-QFN; Manufacturer: Intersil; Voltage - Input: 4.5 V ~ 25 V; Number of Outputs: 4; Voltage - Output: Multiple; Category: Integrated Circuits (ICs); Manufacturer Part Number: ISL6236AIRZ; Operating Temperature: -40°C ~ 100°C; Package / Case: 32-VFQFN Exposed Pad; Price 1k [$]: 3.0840; Value: ISL6236AIRZ; Family: PMIC - Voltage Regulators - Special Purpose; Supplier Part Number: ISL6236AIRZ-ND; Supplier: Digikey; Supplier 1: Digi-Key; Supplier Part Number 1: ISL6236AIRZ-ND; RoHS: RoHS Compliant; Stock 1: 0; Pricing 1: 600=4.28 (USD); Applications: Controller, Notebook Power System; Mounting Type: Surface Mount; Supplier Device Package: 32-QFN Exposed Pad (5x5); Packaging: Tube; ComponentLink1URL: http://www.intersil.com/data/fn/fn6453.pdf; ComponentLink1Description: http://www.intersil.com/data/fn/fn6453.pdf